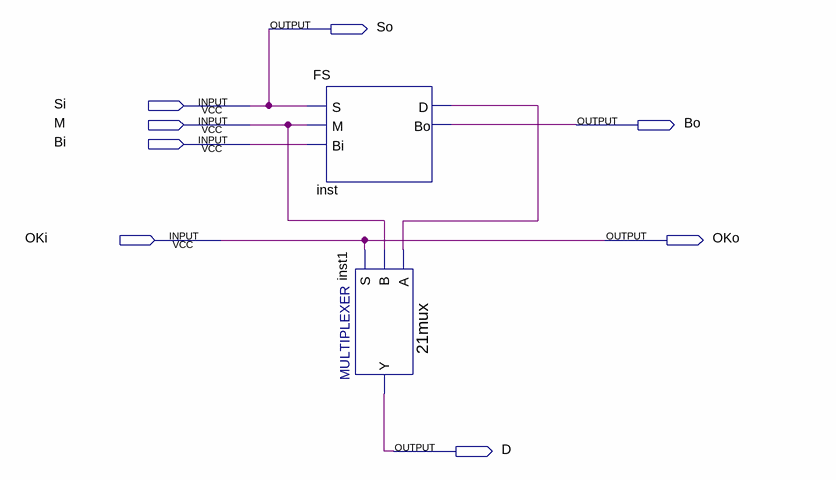
[diagram p0: schematic sheet]
// Quartus schematic div.bdf as structural Verilog: 2 symbols, 8 pins
module div (
  input  Si,
  input  M,
  input  Bi,
  input  OKi,
  output So,
  output Bo,
  output OKo,
  output D
);

  wire inst_d;

  FS inst (.S(Si), .M(M), .Bi(Bi), .D(inst_d), .Bo(Bo));
  \21mux  inst1 (.S(OKi), .B(M), .A(inst_d), .Y(D));

  assign OKo = OKi;
  assign So = Si;
endmodule
